# EAGLE design eos450d (EAGLE 7.2.0)
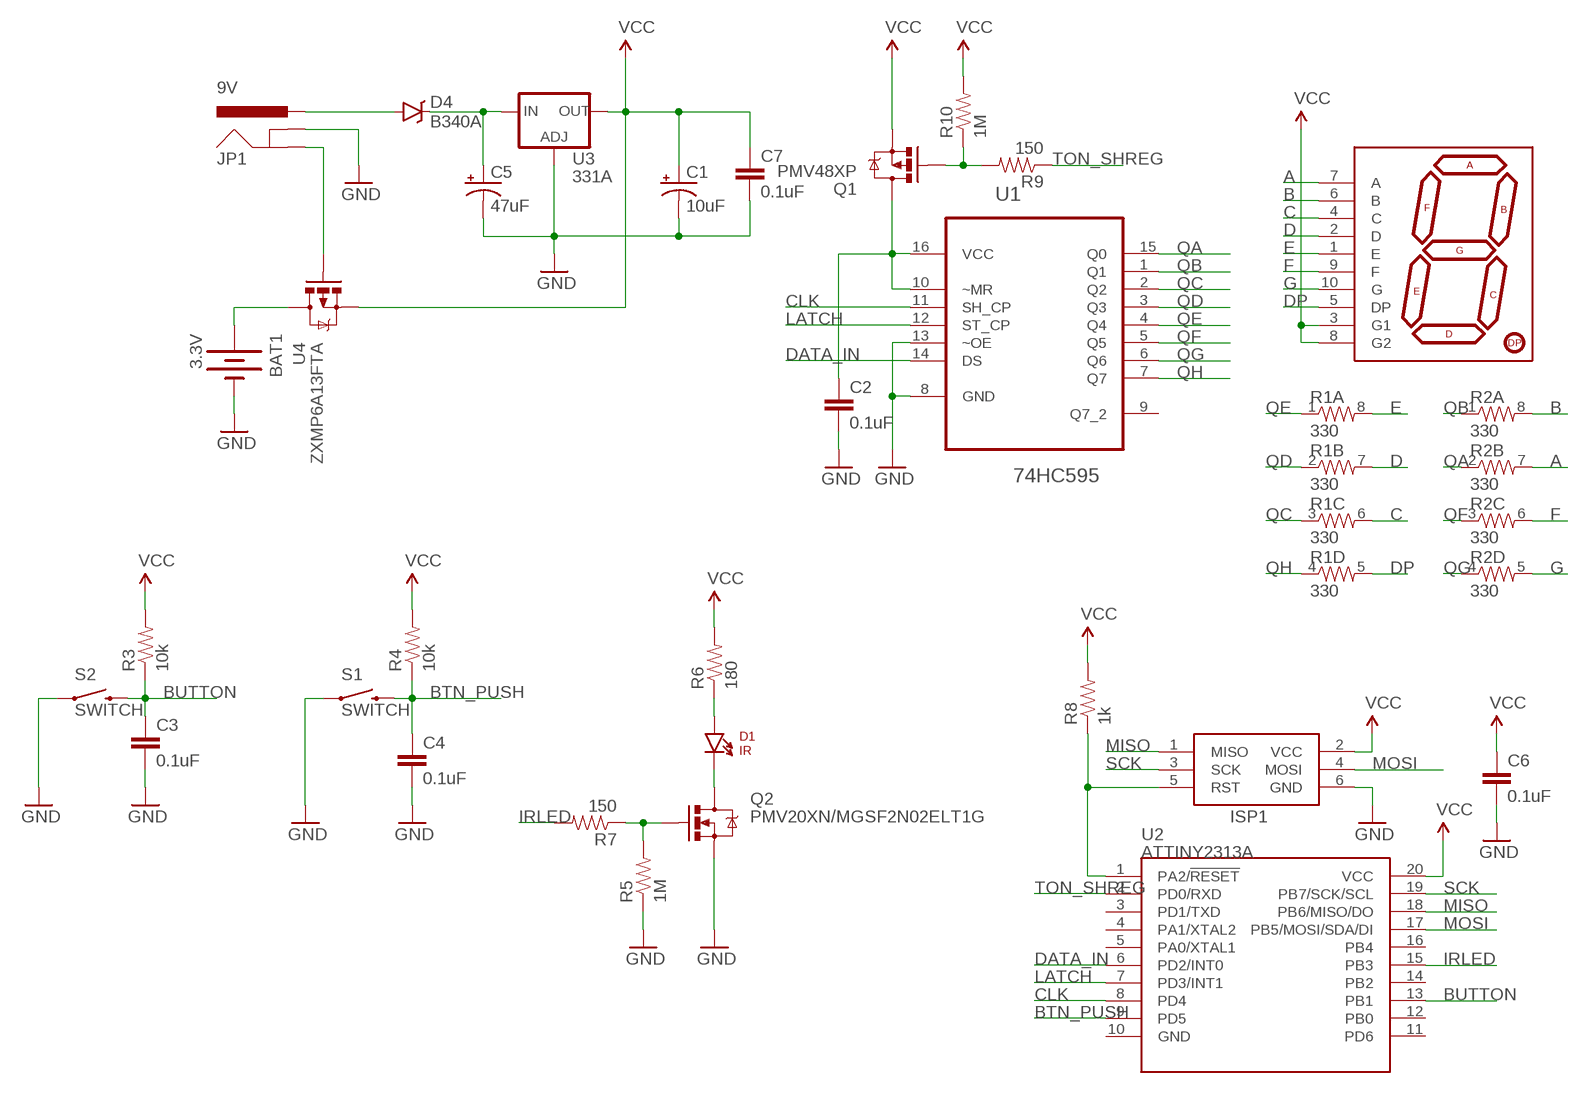
[diagram p0: schematic, sheet 1]

## Parts
BAT1  3.3V  BATTERY20PTH  [BATTCOM_20MM_PTH]
C1  10uF  10UF-16V-10%(TANT)  [EIA3216]
C2  0.1uF  0.1UF-25V-5%(0603)  [0603-CAP]
C3  0.1uF  0.1UF-25V-5%(0603)  [0603-CAP]
C4  0.1uF  0.1UF-25V-5%(0603)  [0603-CAP]
C5  47uF  10UF-20V-10%(TANT)  [EIA3528]
C6  0.1uF  0.1UF-25V-5%(0603)  [0603-CAP]
C7  0.1uF  0.1UF-25V-5%(0603)  [0603-CAP]
D1  IR  LTE-302  [LTE-302]
D2  7-SEGMENT-DISPLAY-1"-REDEZ  [7-SEGMENT-1"PTH-EZ]
D4  B340A  DIODE-SCHOTTKY-B340A  [SMA-DIODE]
ISP1  AVRISP-6  [AVRISP]
JP1  9V  POWER_JACKSLT  [POWER_JACK_SLOT]
Q1  PMV48XP  [SOT23-3]
Q2  PMV20XN/MGSF2N02ELT1G  PMV20XN  [SOT23-3]
R1  330  RESISTOR-ARRAY0603-ARV  [0603-ARV]
R2  330  RESISTOR-ARRAY0603-ARV  [0603-ARV]
R3  10k  RESISTOR0805-RES  [0805]
R4  10k  RESISTOR0805-RES  [0805]
R5  1M  RESISTOR0805-RES  [0805]
R6  180  RESISTOR0805-RES  [0805]
R7  150  RESISTOR0805-RES  [0805]
R8  1k  RESISTOR0805-RES  [0805]
R9  150  RESISTOR0805-RES  [0805]
R10  1M  RESISTOR0805-RES  [0805]
S1  SWITCH  SWITCH-MOMENTARY-2PTH_EZ  [TACTILE-PTH-EZ]
S2  SWITCH  SWITCH-MOMENTARY-2PTH_EZ  [TACTILE-PTH-EZ]
U1  74HC595  74HC595D  [SOIC127P600X175-16N]
U2  ATTINY2313A  [SOP20W]
U3  331A  V_REG_317SMD  [SOT223]
U4  ZXMP6A13FTA  [SOT23-3]

## Nets
A: D2.7(A) R2.7
B: D2.6(B) R2.8
BTN_PUSH: C4.1 R4.1 S1.3 U2.9(PD5)
BUTTON: C3.1 R3.1 S2.3 U2.13(PB1)
C: D2.4(C) R1.6
CLK: U1.11(SH_CP) U2.8(PD4)
D: D2.2(D) R1.7
DATA_IN: U1.14(DS) U2.6(PD2/INT0)
DP: D2.5(DP) R1.5
E: D2.1(E) R1.8
F: D2.9(F) R2.6
G: D2.10(G) R2.5
GND: BAT1.2(-) C1.C(-) C2.2 C3.2 C4.2 C5.C(-) C6.2 C7.2 ISP1.6(GND) JP1.GND@1(GNDBREAK) Q2.2(S) R5.1 S1.1 S2.1 U1.8(GND) U1.13(~OE) U3.1(ADJ)
IRLED: R7.2 U2.15(PB3)
LATCH: U1.12(ST_CP) U2.7(PD3/INT1)
MISO: ISP1.1(MISO) U2.18(PB6/MISO/DO)
MOSI: ISP1.4(MOSI) U2.17(PB5/MOSI/SDA/DI)
N$1: D1.A R6.1
N$2: Q2.1(G) R5.2 R7.1
N$3: D1.C Q2.3(D)
N$4: Q1.1(G) R9.2 R10.1
N$5: C2.1 Q1.3(D) U1.10(~MR) U1.16(VCC)
N$6: C5.A(+) D4.C U3.3(IN)
N$7: ISP1.5(RST) R8.1 U2.1(PA2/!RESET)
N$10: D4.A JP1.PWR
N$11: BAT1.1(+) U4.3(D)
N$12: JP1.GND@2(GND) U4.1(G)
QA: R2.2 U1.15(Q0)
QB: R2.1 U1.1(Q1)
QC: R1.3 U1.2(Q2)
QD: R1.2 U1.3(Q3)
QE: R1.1 U1.4(Q4)
QF: R2.3 U1.5(Q5)
QG: R2.4 U1.6(Q6)
QH: R1.4 U1.7(Q7)
SCK: ISP1.3(SCK) U2.19(PB7/SCK/SCL)
TON_SHREG: R9.1 U2.2(PD0/RXD)
VCC: C1.A(+) C6.1 C7.1 D2.3(G1) D2.8(G2) ISP1.2(VCC) Q1.2(S) R3.2 R4.2 R6.2 R8.2 R10.2 U2.20(VCC) U3.2(OUT) U4.2(S)
Unconnected: U1.9(Q7_2) U2.3(PD1/TXD) U2.4(PA1/XTAL2) U2.5(PA0/XTAL1) U2.10(GND) U2.11(PD6) U2.12(PB0) U2.14(PB2) U2.16(PB4)

## Library data of the parts
BAT1 = SparkFun-Electromechanical:BATTERY: Battery Holders Various common sizes : AA, AAA, 18650 (PRT-12895), 20mm coin cell and 12mm coin cell. 20MM_4LEGS, BATT-10373
C1 = SparkFun-Capacitors:10UF-16V-10%(TANT): CAP-00811 1206/EIA-3216 Tantalum capacitor; PROD_ID: CAP-00811
C2-C4 C6 C7 = SparkFun-Capacitors:0.1UF-25V-5%(0603): CAP-08604; PROD_ID: CAP-08604
C5 = SparkFun-Capacitors:10UF-20V-10%(TANT): CAP-08063; PROD_ID: CAP-08063; VALUE: 10uF
D1 = SparkFun-LED:LTE-302: Through-hole side-firing 940nm IR LED
D2 = SparkFun-Displays:7-SEGMENT-DISPLAY-1"-RED: 7-Segment Display 1" Red (COM-08546) EZ is for kits. Pads are only exposed on the bottom side to help prevent soldering in upside down.
D4 = SparkFun-DiscreteSemi:DIODE-SCHOTTKY: Schottky diodes in SFE's production catalog BAT20J 1A 23V 0.62Vf RB751 120mA 40V 0.37Vf PMEG4005EJ 0.5A 40V 0.42Vf MBRA140 1A 40V 0.5Vf B340A 3A 40V SMA; PROD_ID: DIO-09886
ISP1 = adafruit:AVRISP: AVR ISP HEADER Standard 6 pin header for AVR programming
JP1 = SparkFun-Connectors:POWER_JACK: Power Jack This is the standard 5.5mm barrel jack for power. The PTH is the most common, proven, reliable, footprint. The Slot footprint only works if the mill layer is transmitted to the PCB fab house so be warned. Mating wall wart : TOL-00298 (and others); PROD_ID: PRT-00119
Q1 = mine-mosfet:PMV48XP
Q2 = mine-mosfet:PMV20XN
R1 R2 = SparkFun-Passives:RESISTOR-ARRAY: Array Chip Resistor Source: RS Component / Phycomp
R3-R10 = SparkFun-Passives:RESISTOR: Resistor Basic schematic elements and footprints for 0603, 1206, and PTH resistors.
S1 S2 = SparkFun-Electromechanical:SWITCH-MOMENTARY-2: Various NO switches- pushbuttons, reed, etc
U1 = mine-mosfet:74HC595D: 8-bit serial-in parallel-out shift register; MPN: 74HC595D; OC_FARNELL: 1201269; OC_NEWARK: 26M7771; PACKAGE: SOIC-16; SUPPLIER: NXP
U2 = SparkFun-DigitalIC:ATTINY2313A: ATTINY2313A 2kB 20MHz I2C/SPI/UART; PROD_ID: IC-11305
U3 = SparkFun-PowerIC:V_REG_317: Voltage Regulator Standard LM317 adjustable voltage regulator. AOI (Adjust Output Input). Google 'LM317 Calculator' for easy to use app to get the two resistor values needed. 240/720 for 5V output. 240/390 for 3.3V output. Spark Fun Electronics SKU : COM-00527
U4 = mine-mosfet:ZXMP6A13FTA: 60V P-CHANNEL ENHANCEMENT MODE MOSFET

## Board
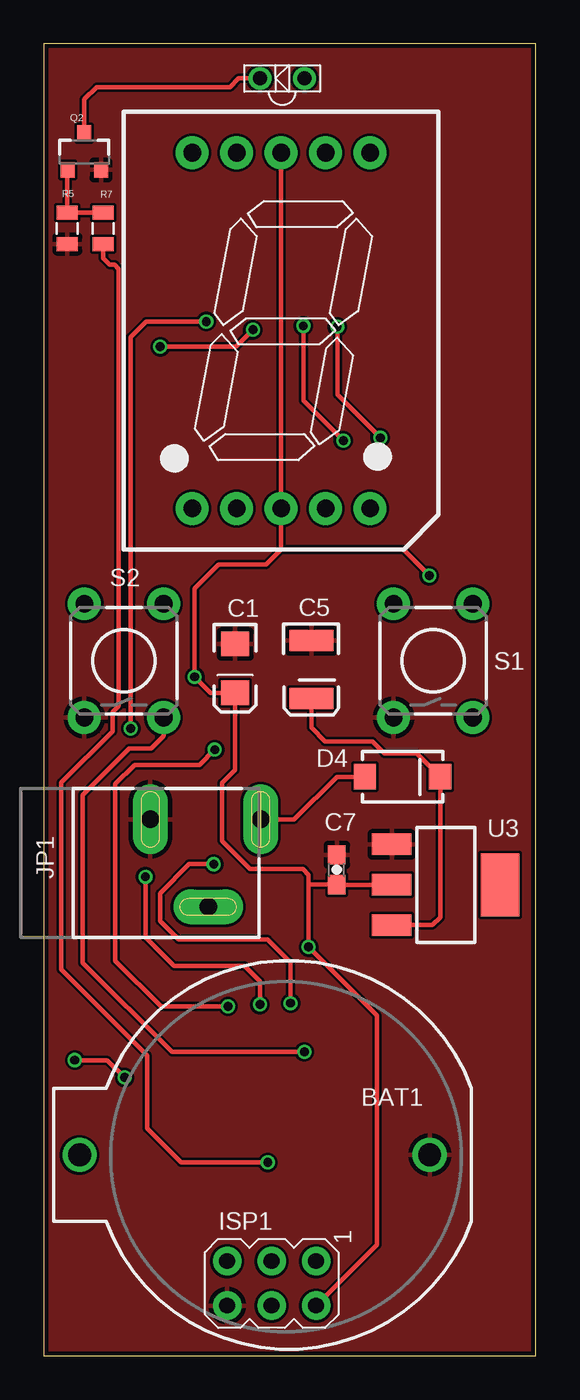
[diagram p1: board, top side]
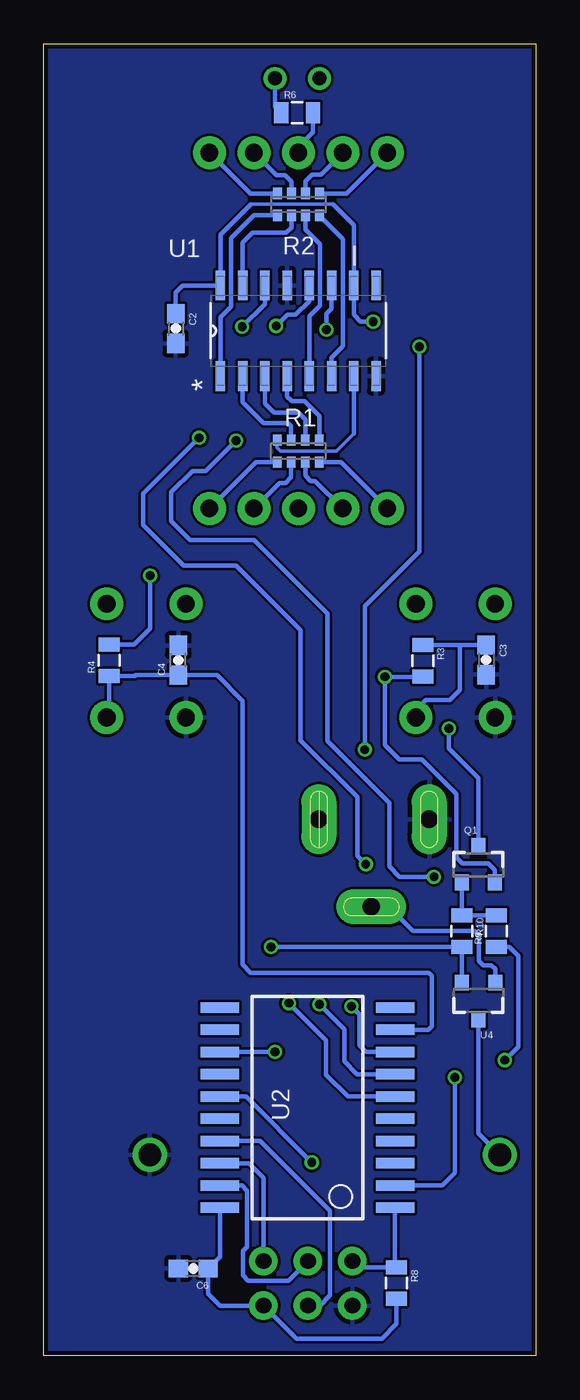
[diagram p2: board, bottom side, seen from below]

Size 28.11 x 74.92 mm. Coordinates in mm from the lower left corner, seen from the top.
Outline: 0,0.01 28.11,0 28.11,74.91 0,74.92 0,0.01
Copper layers (1*16): Top 0.035mm / dielectric 1.5mm / Bottom 0.035mm
Design rules "SeeedStudio_2layer_DRU_no_angle_20140221": minimum track width 6mil, minimum drill 12mil, track to track 6mil, track to pad 6mil, pad to pad 6mil, via to via 6mil, smd to smd 0mil, copper to edge 10mil, drill to drill 10mil, minimum pad ring 10mil, minimum via ring 6mil, stop-mask expansion 2mil, vias tented up to drill 100mil, thermal gap 10mil

### Footprints (pad centres in the part's own frame; a part is rotated, then mirrored left to right if it is on the bottom)
BATTCOM_20MM_PTH = drill 1.3: 1 11.85,0; 2 -8.15,0
EIA3216 = smd 1.4 x 1.6: A 1.4,0; C -1.4,0
0603-CAP = smd 1.1 x 1: 1 -0.85,0; 2 0.85,0
EIA3528 = smd 1.2 x 2.5: A 1.65,0; C -1.65,0
LTE-302 = drill 0.8: A 1.27,0; C -1.27,0
7-SEGMENT-1"PTH-EZ = drill 1 pad 1.88: 1 -5.08,-10.16; 2 -2.54,-10.16; 3 0,-10.16; 4 2.54,-10.16; 5 5.08,-10.16; 6 5.08,10.16; 7 2.54,10.16; 8 0,10.16; 9 -2.54,10.16; 10 -5.08,10.16
SMA-DIODE = smd 1.27 x 1.47: A -2.15,0; C 2.15,0
AVRISP = drill 0.9 pad 1.626: 1 -1.27,2.54; 2 1.27,2.54; 3 -1.27,0; 4 1.27,0; 5 -1.27,-2.54; 6 1.27,-2.54
POWER_JACK_SLOT = drill 1 pad 2 long: GND@1 2.58,7.5; GND@2 7.58,10.8; PWR 2.58,13.8
SOT23-3 = smd 0.8 x 0.9: 1 -0.95,-1; 2 0.95,-1; 3 0,1.1
0603-ARV = smd 0.5 x 0.65: 1 -1.2,-0.625; 2 -0.4,-0.625; 3 0.4,-0.625; 4 1.2,-0.625; 5 1.2,0.625; 6 0.4,0.625; 7 -0.4,0.625; 8 -1.2,0.625
0805 = smd 0.8 x 1.2: 1 -0.9,0; 2 0.9,0
TACTILE-PTH-EZ = drill 1.016 pad 1.88: 1 -3.251,2.261; 2 3.251,2.261; 3 -3.251,-2.261; 4 3.251,-2.261
SOIC127P600X175-16N = smd 1.702 x 0.533: 1 -2.591,4.445; 2 -2.591,3.175; 3 -2.591,1.905; 4 -2.591,0.635; 5 -2.591,-0.635; 6 -2.591,-1.905; 7 -2.591,-3.175; 8 -2.591,-4.445; 9 2.591,-4.445; 10 2.591,-3.175; 11 2.591,-1.905; 12 2.591,-0.635; 13 2.591,0.635; 14 2.591,1.905; 15 2.591,3.175; 16 2.591,4.445
SOP20W = smd 0.6 x 2.2: 1 -5.715,-5; 2 -4.445,-5; 3 -3.175,-5; 4 -1.905,-5; 5 -0.635,-5; 6 0.635,-5; 7 1.905,-5; 8 3.175,-5; 9 4.445,-5; 10 5.715,-5; 11 5.715,5; 12 4.445,5; 13 3.175,5; 14 1.905,5; 15 0.635,5; 16 -0.635,5; 17 -1.905,5; 18 -3.175,5; 19 -4.445,5; 20 -5.715,5
SOT223 = smd 1.219 x 2.235: 1 -2.311,-3.099; 2 0,-3.099; 3 2.311,-3.099 | smd 3.6 x 2.2: 4 0,3.099

### Placement (x,y rotation side)
BAT1  13.9,11.47 180 top
C1  10.94,39.25 270 top
C2  20.57,58.66 270 bottom
C3  2.83,39.74 270 bottom
C4  20.42,39.72 90 bottom
C5  15.29,39.19 270 top
C6  19.57,4.98 180 bottom
C7  16.74,27.75 90 top
D1  13.62,72.94 0 top
D2  13.56,58.54 0 top
D4  20.5,33.06 0 top
ISP1  13.02,4.13 270 top
JP1  -1.41,33.21 270 top
Q1  3.28,28.03 0 bottom
Q2  2.32,68.72 0 top
R1  13.57,51.66 180 bottom
R2  13.56,65.74 0 bottom
R3  6.46,39.68 270 bottom
R4  24.36,39.72 90 bottom
R5  1.35,64.38 90 top
R6  13.64,70.98 0 bottom
R7  3.39,64.38 270 top
R8  7.95,4.15 270 bottom
R9  2.25,24.24 90 bottom
R10  4.22,24.24 270 bottom
S1  22.25,39.69 90 top
S2  4.58,39.69 90 top
U1  13.57,58.53 90 bottom
U2  13.04,14.17 90 bottom
U3  22.98,26.89 270 top
U4  3.27,20.3 180 bottom

### Tracks (layer width: path | path; a pad name or v marks a point on that pad's centre or on a via)
A
  Bottom 0.25: R2.7 13.96,67.05 14.32,67.41 14.81,67.41 D2.7
B
  Bottom 0.25: R2.8 16.3,66.37 D2.6
BTN_PUSH
  Bottom 0.25: S1.3 24.36,36.59 R4.1 22.9,38.82 22.85,38.87 20.95,38.87 | C4.1 20.95,38.87 | U2.9 6.12,18.62 5.94,18.8 5.94,21.7 6.11,21.87 16.29,21.87 16.76,22.34 16.76,37.4 18.22,38.86 20.94,38.86 20.95,38.87
BUTTON  (via drill 0.5)
  Top 0.25: v14.89,17.35 v14.88,17.34 7.32,17.34 2.22,22.44 2.22,32.02 4.87,34.67 6.12,34.67 6.84,35.39 S2.3
  Bottom 0.25: R3.1 4.4,40.58 | v14.89,17.35 U2.13 | 4.4,40.58 C3.1 | S2.3 6.84,36.89 6.28,37.45 4.91,37.45 4.35,38.01 4.35,40.53 4.4,40.58
C
  Bottom 0.25: R1.6 13.97,50.18 14.31,49.84 14.64,49.84 D2.4
CLK  (via drill 0.5)
  Top 0.25: v10.53,19.95 6.7,19.95 4.09,22.56 4.09,32.64 5.18,33.73 8.89,33.73 v9.77,34.61 | v6.65,57.62 10.98,57.62 v11.95,58.59
  Bottom 0.25: U2.8 9.7,17.35 10.08,17.73 10.08,19.5 v10.53,19.95 | v9.77,34.61 9.77,42.81 6.65,45.93 v6.65,57.62 | v11.95,58.59 11.95,59.51 11.67,59.79 U1.11
D
  Bottom 0.25: R1.7 13.17,50.27 12.86,49.96 12.6,49.96 D2.2
DATA_IN  (via drill 0.5)
  Top 0.25: v14.1,20.13 14.1,22.45 12.79,23.76 7.7,23.76 6.64,24.82 6.64,26.41 8.3,28.07 v9.71,28.07 | v16.77,58.76 16.77,54.88 v19.23,52.42
  Bottom 0.25: U2.6 10.73,14.8 11.98,16.05 11.98,18.01 v14.1,20.13 | U1.14 15.47,60.05 v16.77,58.76 | v19.23,52.42 22.43,49.22 22.43,47.43 20.12,45.12 17.12,45.12 13.43,41.43 13.43,35.14 10.19,31.9 10.19,28.55 v9.71,28.07
DP
  Bottom 0.25: R1.5 15.98,51.03 D2.5
E
  Bottom 0.25: R1.8 11.13,51.03 D2.1
F
  Bottom 0.25: R2.6 13.16,67.06 12.78,67.44 12.28,67.44 D2.9
G
  Bottom 0.25: R2.5 10.81,66.37 D2.10
GND
  pour Top: 0.02,74.9 28.18,74.9 28.16,0.01 0,0.01
  pour Bottom: 0,74.87 28.16,74.87 28.16,0.01 0,0.01
IRLED  (via drill 0.5)
  Top 0.25: v12.8,11.04 7.85,11.04 5.91,12.98 5.91,17.16 1.01,22.06 1.01,32.74 3.93,35.66 3.93,36.75 4.29,37.11 4.29,62.05 4.04,62.3 3.77,62.3 3.39,62.68 R7.2
  Bottom 0.25: v12.8,11.04 16.57,14.8 U2.15
LATCH  (via drill 0.5)
  Top 0.25: v12.35,20.06 12.35,21.38 11.48,22.25 7.45,22.25 5.81,23.89 v5.81,27.35 | v14.83,58.81 14.83,54.55 v17.12,52.26
  Bottom 0.25: U2.7 10.21,16.08 10.93,16.8 10.93,18.64 v12.35,20.06 | U1.12 12.94,60.23 13.72,59.45 14.19,59.45 v14.83,58.81 | v17.12,52.26 18.86,50.52 19.62,50.52 20.83,49.31 20.83,47.66 19.74,46.57 16.1,46.57 11.9,42.37 11.9,35.11 8.36,31.57 8.36,27.93 7.78,27.35 v5.81,27.35
MISO
  Bottom 0.25: ISP1.1 15.56,10.17 16.39,11 U2.18
MOSI
  Bottom 0.25: U2.17 15.74,12.27 11.75,8.28 11.75,3.45 12.34,2.86 ISP1.4
N$1
  Bottom 0.25: D1.A 14.89,71.33 R6.1
N$2
  Top 0.25: Q2.1 1.35,67.7 R5.2 3.17,65.27 3.18,65.28 R7.1
N$3
  Top 0.25: Q2.3 2.32,71.75 3.01,72.44 10.64,72.44 11.14,72.94 D1.C
N$4
  Bottom 0.25: R9.2 R10.1 Q1.1
N$5  (via drill 0.5)
  Top 0.25: v9.29,59.06 5.84,59.06 4.95,58.17 v4.97,35.82
  Bottom 0.2: 11.58,65.75 16.28,65.75
  Bottom 0.25: C2.1 20.57,60.72 20.17,61.12 U1.16 18.01,64.02 16.28,65.75 | 11.58,65.75 10.39,64.57 U1.10 10.4,59.45 10.01,59.06 v9.29,59.06 | 4.97,35.4 v4.97,35.82 4.97,34.68 3.28,32.99 Q1.3
N$6
  Top 0.25: C5.A 15.29,35.87 16.08,35.08 18.79,35.08 19.47,34.4 21.31,34.4 D4.C 22.65,25.03 22.21,24.59 19.89,24.59 U3.3
N$7
  Bottom 0.25: ISP1.5 10.13,5.05 R8.1 8.04,5.14 U2.1
N$10
  Top 0.25: D4.A 16.74,33.06 14.31,30.63 JP1.PWR
N$11
  Bottom 0.25: U4.3 3.27,12.69 BAT1.1
N$12
  Bottom 0.25: U4.1 2.32,22.08 2.53,22.29 2.99,22.29 3.25,22.55 3.25,23.99 3.52,24.26 7.03,24.26 8.4,25.63 JP1.GND@2
QA
  Bottom 0.25: R2.2 13.96,64.42 14.26,64.12 16.18,64.12 16.74,63.56 U1.15
QB
  Bottom 0.25: U1.1 18.02,59.3 17.4,59.92 17.4,63.81 16.09,65.12 R2.1
QC
  Bottom 0.25: R1.3 13.97,53.08 14.16,53.27 15.55,53.27 16.75,54.47 U1.2
QD
  Bottom 0.25: R1.2 13.17,53.47 13.56,53.86 14.96,53.86 15.47,54.37 U1.3
QE
  Bottom 0.25: U1.4 14.21,54.78 13.93,54.51 13.22,54.51 12.37,53.66 R1.1
QF
  Bottom 0.25: R2.3 13.16,64.31 12.34,63.49 12.34,59.97 12.94,59.38 U1.5
QG
  Bottom 0.25: U1.6 11.66,57 11.01,57.66 11.01,63.77 R2.4
QH
  Bottom 0.2: R1.4 14.77,51.85 14.58,51.66 11.4,51.66 10.4,52.66
  Bottom 0.25: 10.4,52.66 U1.7
SCK
  Bottom 0.25: U2.19 16.79,9.72 16.49,9.43 16.49,6.23 16.73,5.99 16.73,4.59 16.43,4.29 14.13,4.29 ISP1.3
TON_SHREG  (via drill 0.5)
  Top 0.25: v1.77,16.88 3.63,16.88 v4.62,15.89
  Bottom 0.25: R9.1 1.51,23.34 1.01,22.84 1.01,17.64 v1.77,16.88 | v4.62,15.89 4.62,10.44 5.33,9.73 U2.2
VCC  (via drill 0.5)
  Top 0.25: D2.8 D2.3 13.56,46.04 | 13.56,46.04 12.7,45.18 10,45.18 8.62,43.8 v8.62,38.77 9.54,37.85 C1.A 10.94,33.46 10.19,32.71 10.19,29.4 11.79,27.8 14.8,27.8 15.13,27.47 15.13,26.9 | 13.56,46.04 20.54,46.04 v22.03,44.55 | U3.2 C7.1 15.13,26.9 | 15.13,26.9 v15.13,23.34 19.03,19.44 19.03,6.33 ISP1.2
  Bottom 0.25: D2.8 13.56,69.04 12.73,69.87 R6.2 | U4.2 R10.2 v15.13,23.34 | R8.2 7.95,1.82 8.79,0.98 13.68,0.98 ISP1.2 18.03,2.86 18.72,3.55 C6.1 18.04,5.66 U2.20 | R3.2 v8.62,38.77 8.62,34.89 7.79,34.06 6.5,34.06 4.53,32.09 4.53,28.45 4.19,28.11 2.7,28.11 2.33,27.74 Q1.2 | R4.2 22.95,40.62 22.03,41.54 v22.03,44.55

### Text on the board
tValues: CANON EOS / TIMELAPSE CONTROLLER v1.0 | D.GOROHOV @2015 / DC: 7V-12V